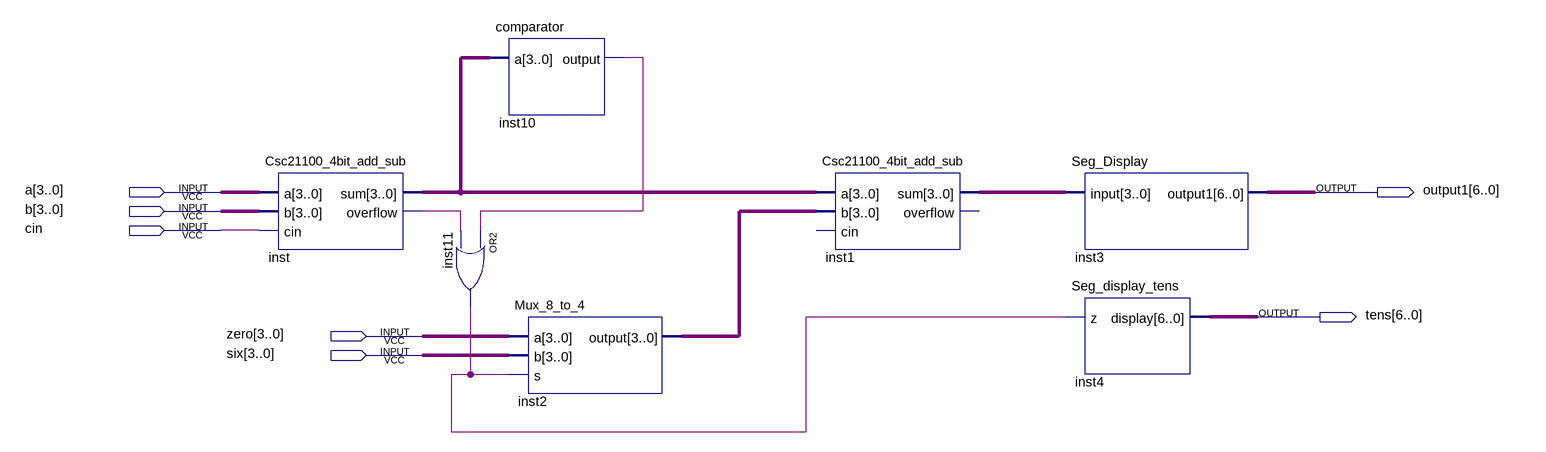
[diagram p0: schematic sheet]
// Quartus schematic Block1.bdf as structural Verilog: 7 symbols, 7 pins
module Block1 (
  input  [3:0] a,
  input  [3:0] b,
  input  cin,
  input  [3:0] zero,
  input  [3:0] six,
  output [6:0] output1,
  output [6:0] tens
);

  wire inst10_output, inst11_out, inst_overflow;
  wire [3:0] inst1_sum, inst2_output, inst_sum;

  Csc21100_4bit_add_sub inst (.a(a), .b(b), .cin(cin), .sum(inst_sum), .overflow(inst_overflow));
  or inst11 (inst11_out, inst10_output, inst_overflow);
  comparator inst10 (.a(inst_sum), .\output (inst10_output));
  Mux_8_to_4 inst2 (.a(zero), .b(six), .s(inst11_out), .\output (inst2_output));
  Csc21100_4bit_add_sub inst1 (.a(inst_sum), .b(inst2_output), .sum(inst1_sum));  // open: cin, overflow
  Seg_Display inst3 (.\input (inst1_sum), .output1(output1));
  Seg_display_tens inst4 (.z(inst11_out), .display(tens));
endmodule
